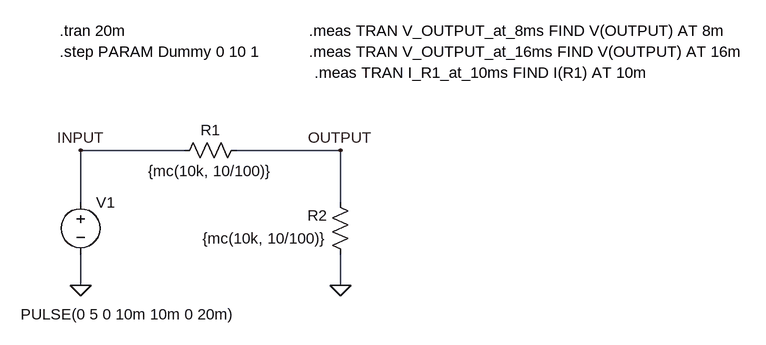
[diagram p0: schematic LTSPICE_Example.asc]
LTSPICE_Example.asc, the LTspice schematic file:
Version 4
SHEET 1 964 680
WIRE 80 0 -80 0
WIRE 320 0 160 0
WIRE -80 80 -80 0
WIRE 320 80 320 0
WIRE -80 208 -80 160
WIRE 320 208 320 160
FLAG 320 208 0
FLAG -80 208 0
FLAG -80 0 INPUT
FLAG 320 0 OUTPUT
SYMBOL res 176 -16 R90
WINDOW 0 0 56 VBottom 2
WINDOW 3 32 56 VTop 2
SYMATTR InstName R1
SYMATTR Value {mc(10k, 10/100)}
SYMBOL res 336 176 R180
WINDOW 0 36 76 Left 2
WINDOW 3 36 40 Left 2
SYMATTR InstName R2
SYMATTR Value {mc(10k, 10/100)}
SYMBOL voltage -80 64 R0
WINDOW 3 -92 189 Left 2
WINDOW 123 0 0 Left 0
WINDOW 39 0 0 Left 0
SYMATTR Value PULSE(0 5 0 10m 10m 0 20m)
SYMATTR InstName V1
TEXT -112 -152 Left 2 !.step PARAM Dummy 0 10 1
TEXT -112 -184 Left 2 !.tran 20m
TEXT 272 -184 Left 2 !.meas TRAN V_OUTPUT_at_8ms FIND V(OUTPUT) AT 8m
TEXT 272 -152 Left 2 !.meas TRAN V_OUTPUT_at_16ms FIND V(OUTPUT) AT 16m
TEXT 280 -120 Left 2 !.meas TRAN I_R1_at_10ms FIND I(R1) AT 10m

The netlist it stands for:
* LTSPICE_Example.asc
R1 OUTPUT INPUT {mc(10k, 10/100)}
R2 0 OUTPUT {mc(10k, 10/100)}
V1 INPUT 0 PULSE(0 5 0 10m 10m 0 20m)
.step PARAM Dummy 0 10 1
.tran 20m
.meas TRAN V_OUTPUT_at_8ms FIND V(OUTPUT) AT 8m
.meas TRAN V_OUTPUT_at_16ms FIND V(OUTPUT) AT 16m
.meas TRAN I_R1_at_10ms FIND I(R1) AT 10m
.backanno
.end